# Altium project PCB_Motor.PrjPcb
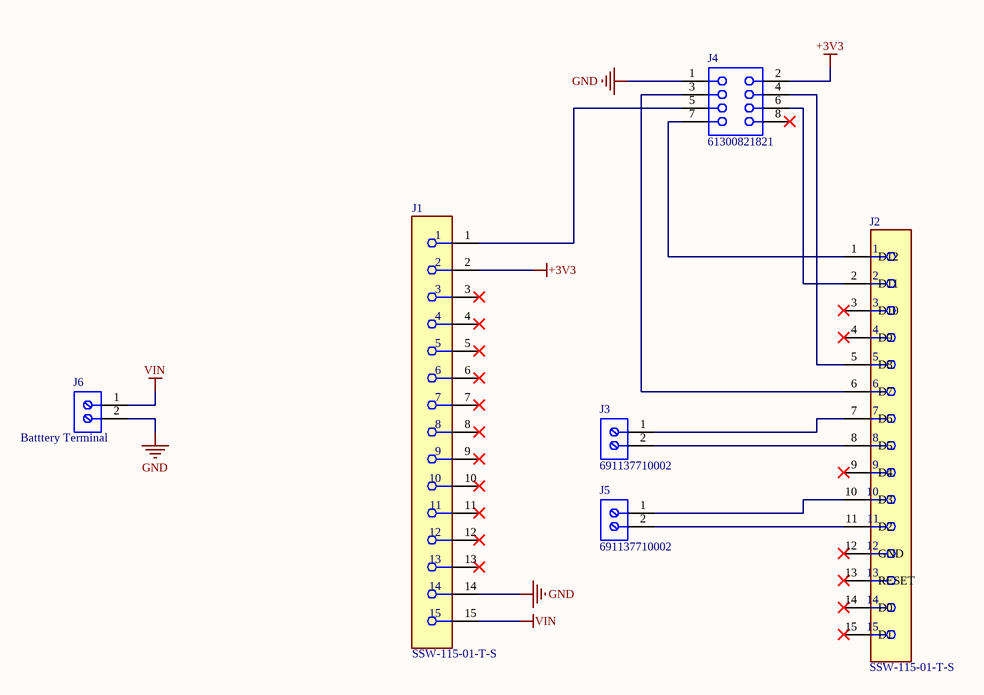
[diagram p0: Prototype V1.SchDoc]
1 sheet, 6 parts. Net scope: global (net labels, ports and power ports of the same name join across sheets).
Board file: PCB1.PcbDoc

## Sheet Prototype V1.SchDoc
size A4; SheetNumber: 1; SheetTotal: 1

### Parts
J1  SSW-115-01-T-S  [FP-SSW-115-01-T-S-MFG]
J2  SSW-115-01-T-S  [FP-SSW-115-01-T-S-MFG]
J3  691137710002  [691137710002]
J4  61300821821  [61300821821]
J5  691137710002  [691137710002]
J6  Batttery Terminal  [691137710002]

### Nets
+3V3: J1.2 J4.2
GND: J1.14 J4.1 J6.2
VIN: J1.15 J6.1
NetJ1_1: J1.1 J4.5
NetJ2_1: J2.1(D12) J4.7
NetJ2_2: J2.2(D11) J4.6
NetJ2_5: J2.5(D8) J4.4
NetJ2_6: J2.6(D7) J4.3
NetJ2_7: J2.7(D6) J3.1
NetJ2_8: J2.8(D5) J3.2
NetJ2_10: J2.10(D3) J5.1
NetJ2_11: J2.11(D2) J5.2

Not connected (* = marked no-connect by the designer): J1 3* 4* 5* 6* 7* 8* 9* 10* 11* 12* 13*; J2 3(D10)* 4(D9)* 9(D4)* 12(GND)* 13(RESET)* 14(D0)* 15(D1)*; J4 8*

### Library data of the parts
J1 J2 = CMP-02766-001723-1: CONN RCPT 15POS 0.1 TIN PCB; Connector Type: Receptacle; Max Voltage Rating (AC): 550V; Mating Cycles: 100; Number of Positions: 15; Pitch: 0.1inch; Max Current Rating: 6.9A; Contact Resistance: 10mR; Contact Type: Female Socket; Color: Black; Depth: 2.41mm; Radiation Hardening: No; Orientation: Straight; Termination: Solder; Series: SSW; Lead Free: Lead Free; Min Operating Temperature: -55°C; Contact Plating: Tin; Contact Material: Bronze; Max Operating Temperature: 105°C; Mount: Through Hole; Packaging: Bulk; Gender: Receptacle; Housing Material: Polymer; RoHS Compliant: Yes; Length: 38.61mm; Number of Rows: 1; REACH SVHC: No SVHC; Width: 2.41mm; Number of Contacts: 15; Housing Color: Black
J3 J5 J6 = CMP-1502-03324-2: NexarPartId: 78871135; Voltage Rating: 300V; Number of Contacts: 2; Current Rating: 16A; Lead Pitch: 5mm; Height: 11.6mm; Packaging: Box; RoHS: Non-Compliant; Contact Material: Nickel, Tin; Max Operating Temperature: 120°C; Number of Pins: 2; Min Operating Temperature: -30°C; Number of Rows: 1
J4 = CMP-1502-01329-3: NexarPartId: 61924725; Operating Supply Voltage: 250V; Contact Resistance: 20mΩ; Gender: Female; Current Rating: 3A; RoHS: Non-Compliant; Lead Pitch: 2.54mm; Number of Pins: 8; Orientation: Vertical